# Altium schematic sheet 10-CELLULAR_COMM.SchDoc
size A4
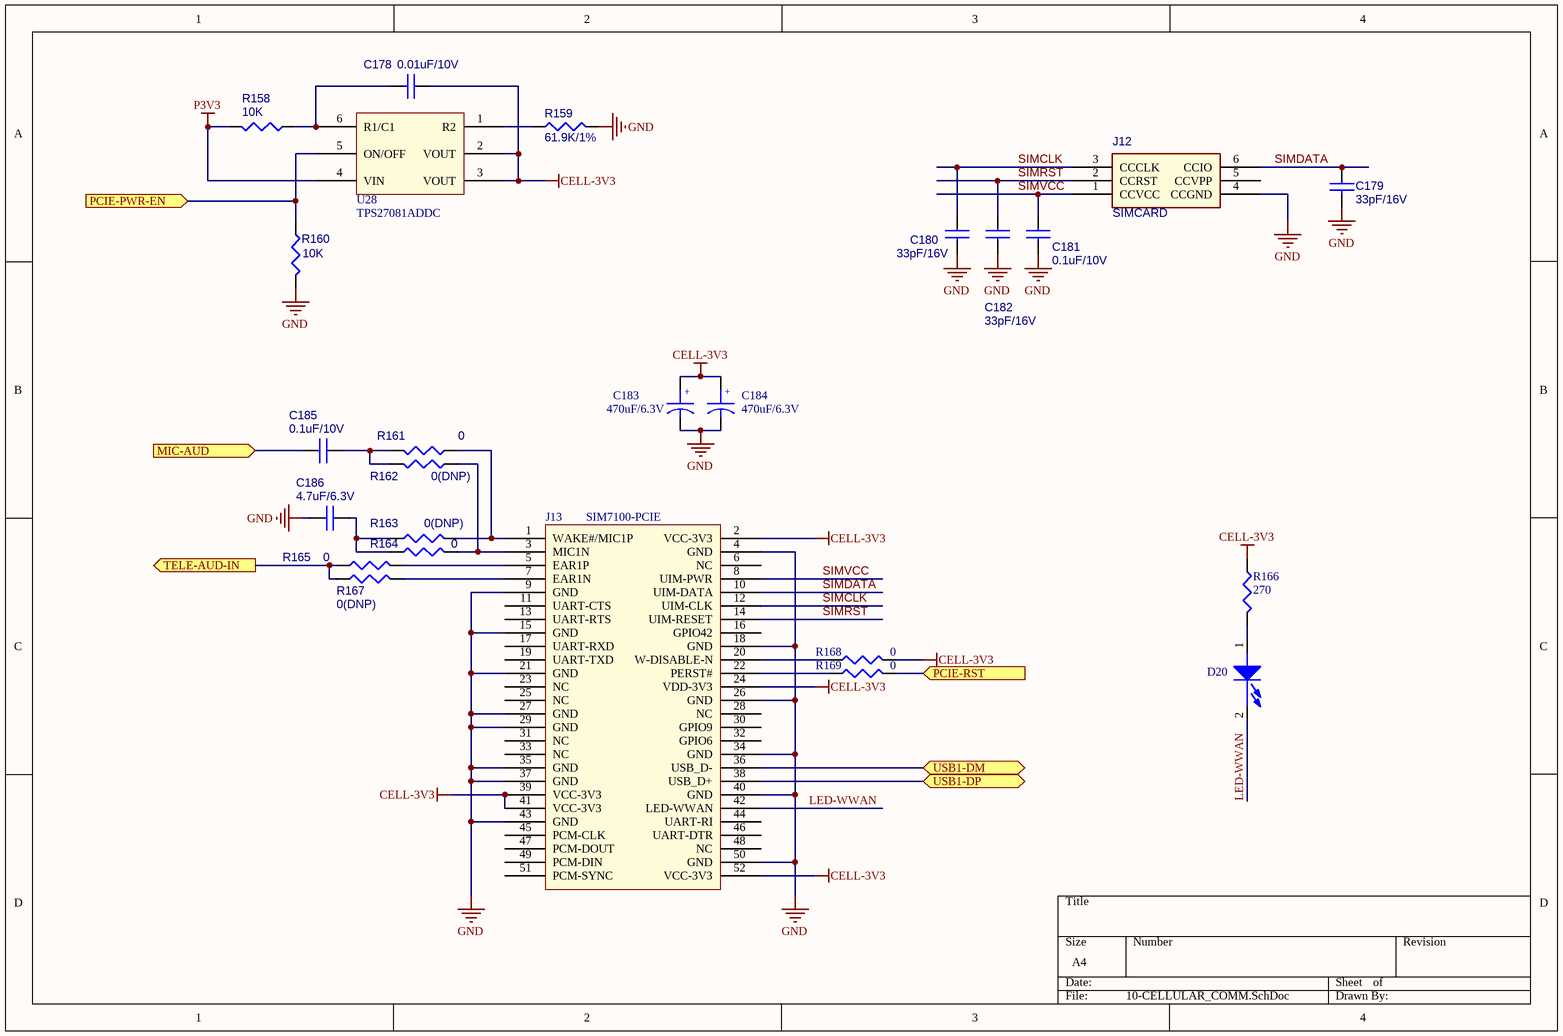
[diagram p0: 10-CELLULAR_COMM.SchDoc]

## Parts
C178  0.01uF/10V  [0402]
C179  33pF/16V  [0402]
C180  33pF/16V  [0402]
C181  0.1uF/10V  [0402]
C182  33pF/16V  [0402]
C183  470uF/6.3V  [7343]
C184  470uF/6.3V  [7343]
C185  0.1uF/10V  [0402]
C186  4.7uF/6.3V  [0603]
D20  LED GREEN  [LED0603]  (value not drawn)
J12  SIMCARD  [SIMLOCK]
J13  SIM7100-PCIE  [MINI-PCIE]
R158  10K  [0402]
R159  61.9K/1%  [0402]
R160  10K  [0402]
R161  0  [0402]
R162  0(DNP)  [0402]
R163  0(DNP)  [0402]
R164  0  [0402]
R165  0  [0402]
R166  270  [0402]
R167  0(DNP)  [0402]
R168  0  [0402]
R169  0  [0402]
U28  TPS27081ADDC  [SOT23-6]

## Ports
MIC-AUD (in), PCIE-PWR-EN (in), PCIE-RST (in), TELE-AUD-IN (out), USB1-DM, USB1-DP

## Nets
CELL-3V3: C178.1 C183.1 C184.1 J13.2(VCC-3V3) J13.24(VDD-3V3) J13.39(VCC-3V3) J13.41(VCC-3V3) J13.52(VCC-3V3) R166.1 R168.2 U28.2(VOUT) U28.3(VOUT)
GND: C179.2 C180.2 C181.2 C182.2 C183.2 C184.2 C186.2 J12.4(CCGND) J13.4(GND) J13.9(GND) J13.15(GND) J13.18(GND) J13.21(GND) J13.26(GND) J13.27(GND) J13.29(GND) J13.34(GND) J13.35(GND) J13.37(GND) J13.40(GND) J13.43(GND) J13.50(GND) R159.1 R160.1
P3V3: R158.1 U28.4(VIN)
LED-WWAN: D20.2(CATHODE) J13.42(LED-WWAN)
MIC-AUD: C185.2 ; port MIC-AUD
PCIE-PWR-EN: R160.2 U28.5(ON/OFF) ; port PCIE-PWR-EN
PCIE-RST: R169.2 ; port PCIE-RST
SIMCLK: C180.1 J12.3(CCCLK) J13.12(UIM-CLK)
SIMDATA: C179.1 J12.6(CCIO) J13.10(UIM-DATA)
SIMRST: C182.1 J12.2(CCRST) J13.14(UIM-RESET)
SIMVCC: C181.1 J12.1(CCVCC) J13.8(UIM-PWR)
TELE-AUD-IN: R165.2 R167.2 ; port TELE-AUD-IN
USB1-DM: J13.36(USB_D-) ; port USB1-DM
USB1-DP: J13.38(USB_D+) ; port USB1-DP
NetC178_2: C178.2 R158.2 U28.6(R1/C1)
NetC185_1: C185.1 R161.1 R162.1
NetC186_1: C186.1 R163.2 R164.2
NetD20_1: D20.1(ANODE) R166.2
NetJ13_1: J13.1(WAKE#/MIC1P) R161.2 R163.1
NetJ13_3: J13.3(MIC1N) R162.2 R164.1
NetJ13_5: J13.5(EAR1P) R165.1
NetJ13_7: J13.7(EAR1N) R167.1
NetJ13_20: J13.20(W-DISABLE-N) R168.1
NetJ13_22: J13.22(PERST#) R169.1
NetR159_2: R159.2 U28.1(R2)

Not connected (* = marked no-connect by the designer): J12 5(CCVPP); J13 6(NC) 11(UART-CTS) 13(UART-RTS) 16(GPIO42) 17(UART-RXD) 19(UART-TXD) 23(NC) 25(NC) 28(NC) 30(GPIO9) 31(NC) 32(GPIO6) 33(NC) 44(UART-RI) 45(PCM-CLK) 46(UART-DTR) 47(PCM-DOUT) 48(NC) 49(PCM-DIN) 51(PCM-SYNC)

## Notes on the sheet
- (in symbol CAP WP) +

## Library data of the parts
C178-C182 C185 C186 = P_CAP NP
C183 C184 = CAP WP
D20 = LN01401_1
R158-R165 R167 = P_R
R166 R168 R169 = CR16-1003FM
U28 = TPS27081A